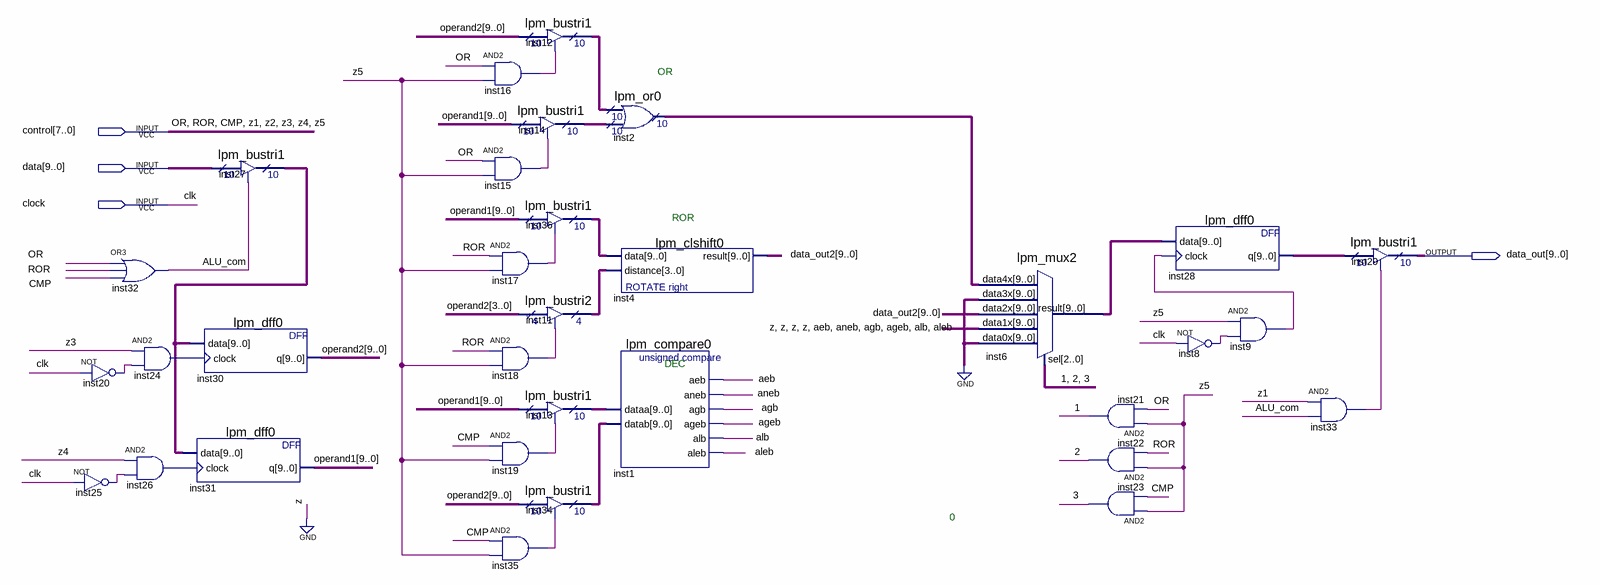
[diagram p0: schematic sheet]
// Quartus schematic ALU.bdf as structural Verilog: 32 symbols, 4 pins
module ALU (
  input  [7:0] control,
  input  [9:0] data,
  input  clock,
  output [9:0] data_out
);

  wire \1 , \2 , \3 , aeb, agb, ageb, alb, aleb, ALU_com, aneb, inst8_out, inst9_out, inst15_out, inst16_out,
       inst17_out, inst18_out, inst19_out, inst20_out, inst24_out, inst25_out, inst26_out, inst33_out,
       inst35_out;
  wire [3:0] inst11_tridata;
  wire [9:0] data_out2, inst2_result, inst6_result, inst12_tridata, inst13_tridata, inst14_tridata,
       inst27_tridata, inst28_q, inst34_tridata, inst36_tridata, operand1, operand2;

  not inst25 (inst25_out, clock);
  or inst32 (ALU_com, control[7], control[6], control[5]);
  and inst24 (inst24_out, control[2], inst20_out);
  not inst20 (inst20_out, clock);
  and inst26 (inst26_out, control[1], inst25_out);
  lpm_dff0 inst30 (.data(inst27_tridata), .clock(inst24_out), .q(operand2));
  lpm_dff0 inst31 (.data(inst27_tridata), .clock(inst26_out), .q(operand1));
  lpm_bustri1 inst27 (.enabledt(ALU_com), .data(data), .tridata(inst27_tridata));
  and inst16 (inst16_out, control[7], control[0]);
  and inst15 (inst15_out, control[7], control[0]);
  lpm_bustri1 inst12 (.enabledt(inst16_out), .data(operand2), .tridata(inst12_tridata));
  lpm_bustri1 inst14 (.enabledt(inst15_out), .data(operand1), .tridata(inst14_tridata));
  lpm_bustri1 inst36 (.enabledt(inst17_out), .data(operand1), .tridata(inst36_tridata));
  and inst17 (inst17_out, control[6], control[0]);
  lpm_bustri2 inst11 (.enabledt(inst18_out), .data(operand2[3:0]), .tridata(inst11_tridata));
  and inst18 (inst18_out, control[6], control[0]);
  lpm_bustri1 inst13 (.enabledt(inst19_out), .data(operand1), .tridata(inst13_tridata));
  and inst19 (inst19_out, control[5], control[0]);
  lpm_bustri1 inst34 (.enabledt(inst35_out), .data(operand2), .tridata(inst34_tridata));
  and inst35 (inst35_out, control[5], control[0]);
  lpm_or0 inst2 (.data0x(inst12_tridata), .data1x(inst14_tridata), .result(inst2_result));
  lpm_clshift0 inst4 (.data(inst36_tridata), .distance(inst11_tridata), .result(data_out2));
  lpm_compare0 inst1 (
    .dataa(inst13_tridata), .datab(inst34_tridata), .aeb(aeb), .aneb(aneb), .agb(agb), .ageb(ageb),
    .alb(alb), .aleb(aleb));
  lpm_mux2 inst6 (
    .data4x(inst2_result), .data3x({10{1'b0}}), .data2x(data_out2),
    .data1x({4'b0000, aeb, aneb, agb, ageb, alb, aleb}), .data0x({10{1'b0}}), .sel({\1 , \2 , \3 }),
    .result(inst6_result));
  and inst21 (\1 , control[0], control[7]);
  and inst22 (\2 , control[0], control[6]);
  and inst23 (\3 , control[0], control[5]);
  lpm_dff0 inst28 (.data(inst6_result), .clock(inst9_out), .q(inst28_q));
  not inst8 (inst8_out, clock);
  and inst9 (inst9_out, control[0], inst8_out);
  lpm_bustri1 inst29 (.enabledt(inst33_out), .data(inst28_q), .tridata(data_out));
  and inst33 (inst33_out, control[4], ALU_com);

  // Other names for the same wires on the sheet: clk = clock; CMP = control[5]; OR = control[7]; ROR = control[6];
  //   z1 = control[4]; z2 = control[3]; z3 = control[2]; z4 = control[1]; z5 = control[0]

  // Notes on the sheet:
  //   OR
  //   ROR
  //   DEC
  //   0
endmodule
